# Altium schematic sheet PIC.SchDoc
size 381 x 254 mm
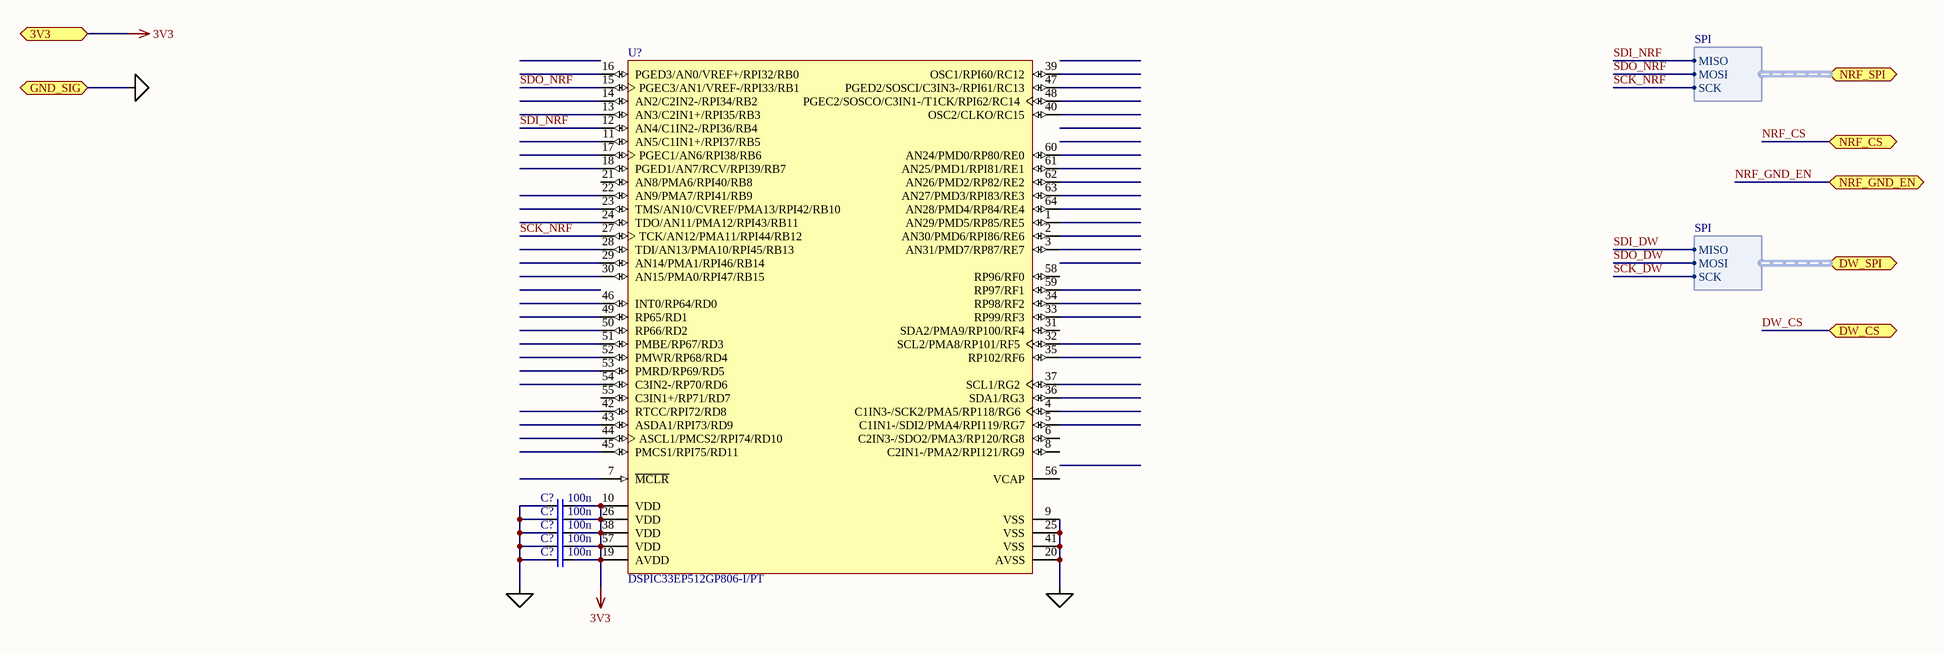
[diagram p0: PIC.SchDoc]

## Parts
(Parts that share a designator on the sheet are numbered #1, #2 ... from top to bottom, then left to right.)
C?#1  human_value: 100n  [C0603]  (hidden comment: __template_cap)
C?#2  human_value: 100n  [C0603]  (hidden comment: __template_cap)
C?#3  human_value: 100n  [C0603]  (hidden comment: __template_cap)
C?#4  human_value: 100n  [C0603]  (hidden comment: __template_cap)
C?#5  human_value: 100n  [C0603]  (hidden comment: __template_cap)
U?  DSPIC33EP512GP806-I/PT  [MCHP-TQFP-PT64_N]

## Ports
3V3, DW_CS, DW_SPI (harness SPI), GND_SIG, NRF_CS, NRF_GND_EN, NRF_SPI (harness SPI)

## Harnesses
SPI: MISO, MOSI, SCK

## Nets
3V3: C?#1.2 C?#2.2 C?#3.2 C?#4.2 C?#5.2 U?.10(VDD) U?.19(AVDD) U?.26(VDD) U?.38(VDD) U?.57(VDD) ; port 3V3
GDNSIG: C?#1.1 C?#2.1 C?#3.1 C?#4.1 C?#5.1 U?.9(VSS) U?.20(AVSS) U?.25(VSS) U?.41(VSS) ; port GND_SIG
DW_CS: port DW_CS
NRF_CS: port NRF_CS
NRF_GND_EN: port NRF_GND_EN
SCK_DW: port DW_SPI.SCK
SCK_NRF: U?.27(TCK/AN12/PMA11/RPI44/RB12) ; port NRF_SPI.SCK
SDI_DW: port DW_SPI.MISO
SDI_NRF: U?.12(AN4/C1IN2-/RPI36/RB4) ; port NRF_SPI.MISO
SDO_DW: port DW_SPI.MOSI
SDO_NRF: U?.15(PGEC3/AN1/VREF-/RPI33/RB1) ; port NRF_SPI.MOSI

Not connected (* = marked no-connect by the designer): U? 1(AN29/PMD5/RP85/RE5) 2(AN30/PMD6/RPI86/RE6) 3(AN31/PMD7/RP87/RE7) 4(C1IN3-/SCK2/PMA5/RP118/RG6) 5(C1IN1-/SDI2/PMA4/RPI119/RG7) 6(C2IN3-/SDO2/PMA3/RP120/RG8) 7(~{MCLR}) 8(C2IN1-/PMA2/RPI121/RG9) 11(AN5/C1IN1+/RPI37/RB5) 13(AN3/C2IN1+/RPI35/RB3) 14(AN2/C2IN2-/RPI34/RB2) 16(PGED3/AN0/VREF+/RPI32/RB0) 17(PGEC1/AN6/RPI38/RB6) 18(PGED1/AN7/RCV/RPI39/RB7) 21(AN8/PMA6/RPI40/RB8) 22(AN9/PMA7/RPI41/RB9) 23(TMS/AN10/CVREF/PMA13/RPI42/RB10) 24(TDO/AN11/PMA12/RPI43/RB11) 28(TDI/AN13/PMA10/RPI45/RB13) 29(AN14/PMA1/RPI46/RB14) 30(AN15/PMA0/RPI47/RB15) 31(SDA2/PMA9/RP100/RF4) 32(SCL2/PMA8/RP101/RF5) 33(RP99/RF3) 34(RP98/RF2) 35(RP102/RF6) 36(SDA1/RG3) 37(SCL1/RG2) 39(OSC1/RPI60/RC12) 40(OSC2/CLKO/RC15) 42(RTCC/RPI72/RD8) 43(ASDA1/RPI73/RD9) 44(ASCL1/PMCS2/RPI74/RD10) 45(PMCS1/RPI75/RD11) 46(INT0/RP64/RD0) 47(PGED2/SOSCI/C3IN3-/RPI61/RC13) 48(PGEC2/SOSCO/C3IN1-/T1CK/RPI62/RC14) 49(RP65/RD1) 50(RP66/RD2) 51(PMBE/RP67/RD3) 52(PMWR/RP68/RD4) 53(PMRD/RP69/RD5) 54(C3IN2-/RP70/RD6) 55(C3IN1+/RP71/RD7) 56(VCAP) 58(RP96/RF0) 59(RP97/RF1) 60(AN24/PMD0/RP80/RE0) 61(AN25/PMD1/RPI81/RE1) 62(AN26/PMD2/RP82/RE2) 63(AN27/PMD3/RPI83/RE3) 64(AN28/PMD4/RP84/RE4)

## Library data of the parts
C?#1-C?#5 = 478-3726-1-ND: voltage: 16.0; type: capacitor; value: 1e-07; tolerance: 5%; Supplier Part Number 1: 478-3726-1-ND; package: 0603; price: 0.374
U? = DSPIC33EP512GP806-I/PT: 16-Bit Microcontroller and Digital Signal Controller with High-Speed PWM, USB and Advanced Analog, 70 MIPS, 53 I/O, PMP, -40 to 85 degC, 64-pin TQFP (PT64), Tray; Manufacturer: Microchip; DatasheetVersion: Rev. G; PackageVersion: C04-085B; PackageReference: TQFP-PT64; PackageDescription: 64-Lead Plastic Thin Quad FlatPack, 10 x 10 mm Body, 0.5 mm Pitch; Supplier 1: Digi-Key; Supplier Part Number 1: DSPIC33EP512GP806-I/PT-ND; Supplier 2: Newark; Supplier Part Number 2: 72T9311; Supplier 3: Mouser; Supplier Part Number 3: 579-33EP512GP806IPT; Mounting Technology: Surface Mount; PartNumber: DSPIC33EP512GP806-I/PT; ComponentLink1Description: Manufacturer URL; ComponentLink1URL: http://www.microchip.com; ComponentLink2Description: Datasheet; ComponentLink2URL: http://ww1.microchip.com/downloads/en/DeviceDoc/70616g.pdf; ComponentLink3Description: Package Specification; ComponentLink3URL: http://www.microchip.com/stellent/groups/techpub_sg/documents/packagingspec/en012702.pdf; ComponentLink4Description: Product URL; ComponentLink4URL: http://www.microchip.com/dsPIC33EP512GP806